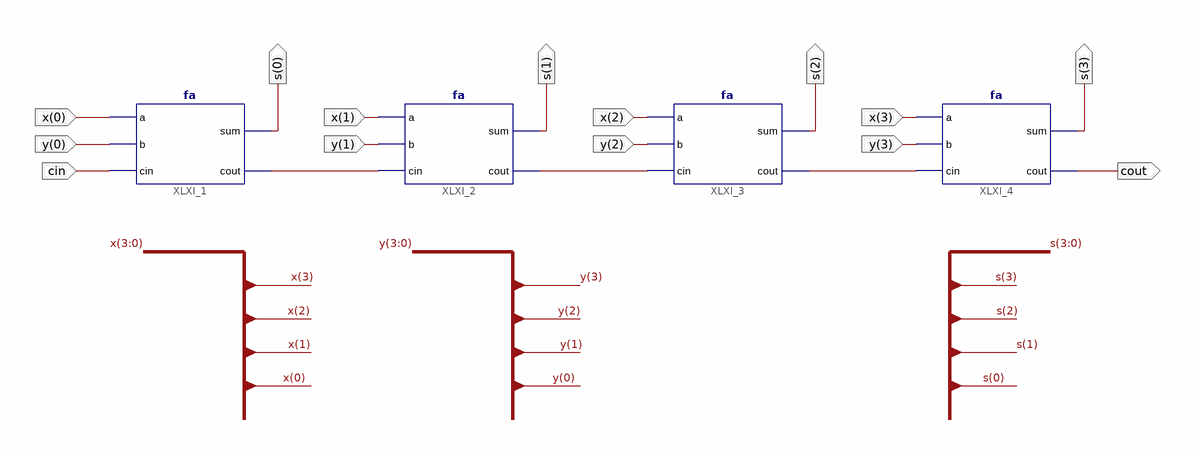
[diagram p0: schematic sheet 1]
// Xilinx ISE schematic myadd4.sch (xc9500) as structural Verilog: 4 symbols, 14 ports
module myadd4 (
  input  [3:0] x,
  input  [3:0] y,
  input  cin,
  output cout,
  output [3:0] s
);

  wire XLXN_3, XLXN_4, XLXN_5;

  fa XLXI_1 (.cout(XLXN_3), .cin(cin), .a(x[0]), .b(y[0]), .sum(s[0]));
  fa XLXI_2 (.cout(XLXN_4), .cin(XLXN_3), .a(x[1]), .b(y[1]), .sum(s[1]));
  fa XLXI_3 (.cout(XLXN_5), .cin(XLXN_4), .a(x[2]), .b(y[2]), .sum(s[2]));
  fa XLXI_4 (.cout(cout), .cin(XLXN_5), .a(x[3]), .b(y[3]), .sum(s[3]));
endmodule
